# EasyEDA schematic SCH_Pico_funboard_core2_2026-02-18.json
TITLE: RP2040 UCompute; REV: 1.3; Date: 2025-12-27; Sheet: 1/1; Company: Your Company
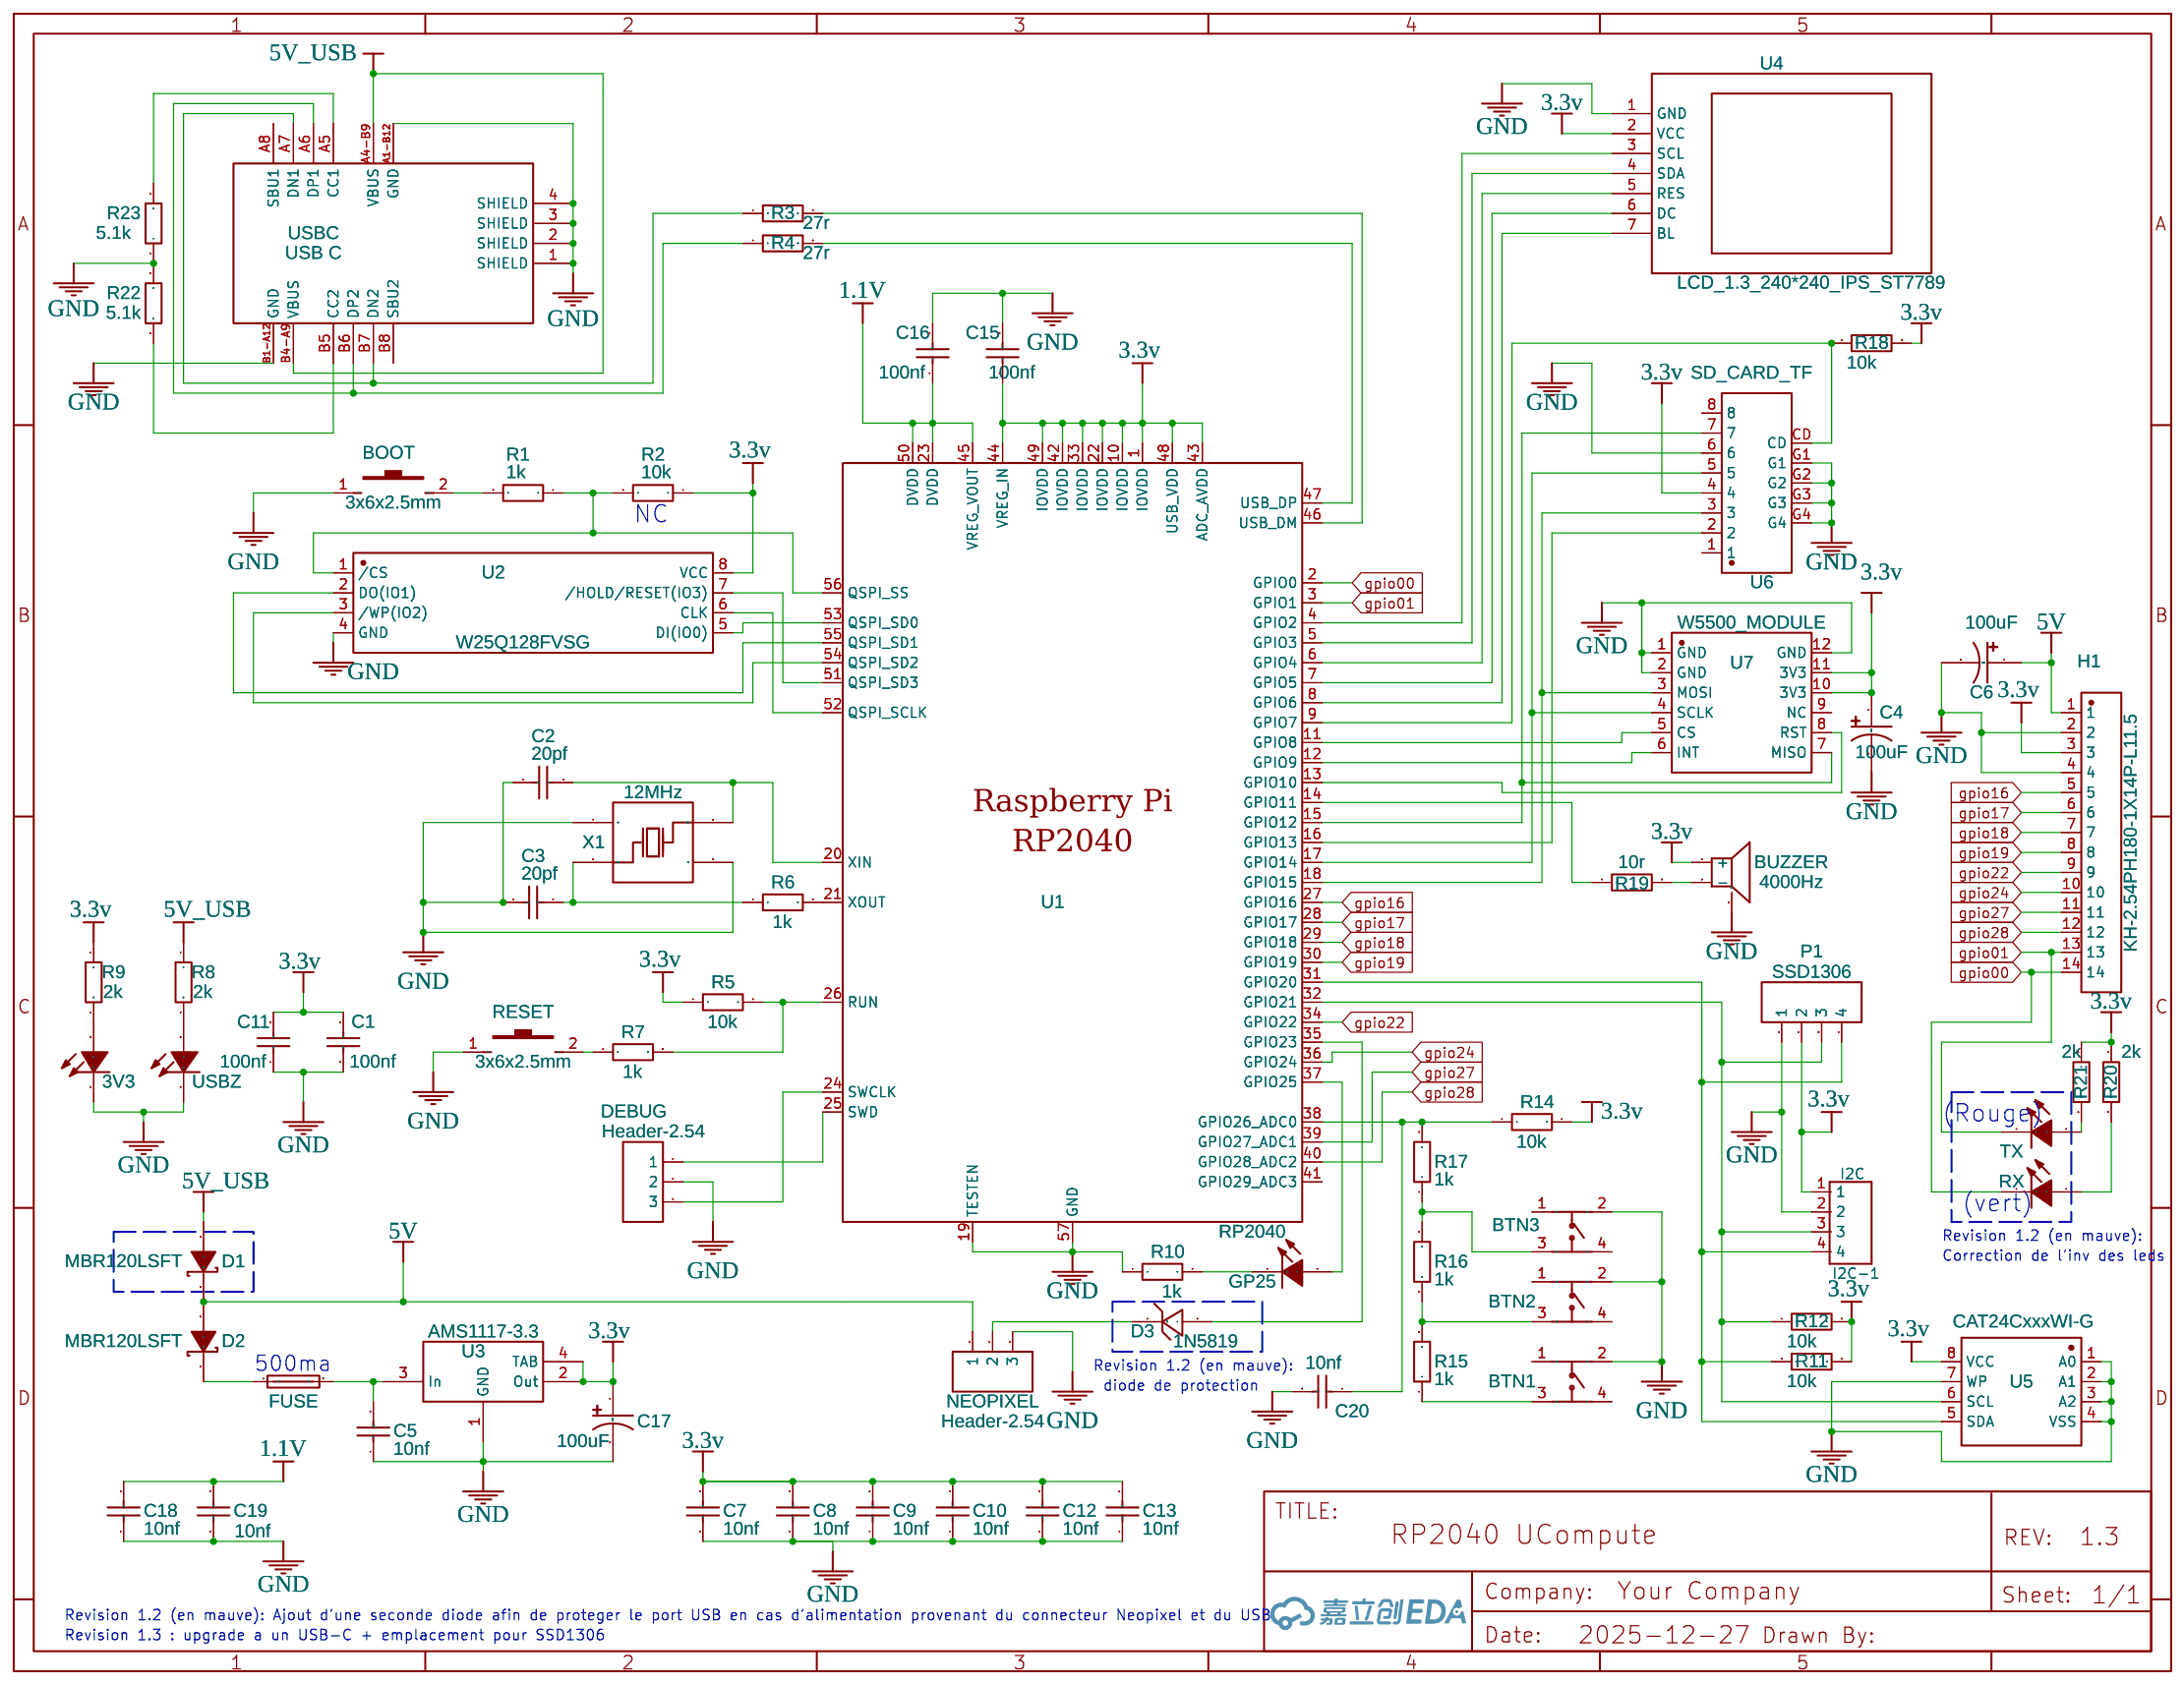
[diagram p0: schematic sheet]

## Parts
3V3  XL-1206QPC  [LED0805-RD_GREEN]
BOOT  3x6x2.5mm  [SW-SMD_L6.0-W3.6-LS8.0]
BTN1  TC-1102-A-J-R  [SW-TH_4P-L6.0-W6.0-P4.50-LS6.5]
BTN2  TC-1102-A-J-R  [SW-TH_4P-L6.0-W6.0-P4.50-LS6.5]
BTN3  TC-1102-A-J-R  [SW-TH_4P-L6.0-W6.0-P4.50-LS6.5]
BUZZER  4000Hz  [BUZ-SMD_3P-L5.2-W5.2-P3.50-BR]
C1  100nf  [C0603]
C2  20pf  [C0603]
C3  20pf  [C0603]
C4  100uF  [CASE-B_3528]
C5  10nf  [C0603]
C6  100uF  [CASE-B_3528]
C7  10nf  [C0603]
C8  10nf  [C0603]
C9  10nf  [C0603]
C10  10nf  [C0603]
C11  100nf  [C0603]
C12  10nf  [C0603]
C13  10nf  [C0603]
C15  100nf  [C0603]
C16  100nf  [C0603]
C17  100uF  [CASE-B_3528]
C18  10nf  [C0603]
C19  10nf  [C0603]
C20  10nf  [C0603]
D1  MBR120LSFT  [DO-214AC_L4.3-W2.7-LS5.3-RD]
D2  MBR120LSFT  [DO-214AC_L4.3-W2.7-LS5.3-RD]
D3  1N5819  [SOD-123_L2.7-W1.6-LS3.7-RD-1]
DEBUG  Header-2.54  [HDR-TH_3P-P2.54-V-M-1]
FUSE  FUSE1206  [F1206]
GP25  XL-1206QPC  [LED0805-RD_BLUE]
H1  KH-2.54PH180-1X14P-L11.5  [HDR-TH_14P-P2.54-V-M]
I2C-1  I2C  [CONN-XH2.54-4PIN]
NEOPIXEL  Header-2.54  [HDR-TH_3P-P2.54-V-M-1]
P1  SSD1306  [HDR-4X1/2.54]
R1  1k  [R0603]
R2  10k  [R0603]
R3  27r  [R0603]
R4  27r  [R0603]
R5  10k  [R0603]
R6  1k  [R0603]
R7  1k  [R0603]
R8  2k  [R0603]
R9  2k  [R0603]
R10  1k  [R0603]
R11  10k  [R0603]
R12  10k  [R0603]
R14  10k  [R0603]
R15  1k  [R0603]
R16  1k  [R0603]
R17  1k  [R0603]
R18  10k  [R0603]
R19  10r  [R0603]
R20  2k  [R0603]
R21  2k  [R0603]
R22  5.1k  [R0603]
R23  5.1k  [R0603]
RESET  3x6x2.5mm  [SW-SMD_L6.0-W3.6-LS8.0]
RX1  RX  [LED0805-RD_BLUE]
TX1  TX  [LED0805-RD_BLUE]
U1  RP2040  [LQFN-56_L7.0-W7.0-P0.4-EP]
U2  W25Q128FVSG  [SOIC-8_L5.2-W5.2-P1.27-LS7.9-BL]
U3  AMS1117-3.3  [SOT-223_L6.5-W3.5-P2.30-LS7.0-BR]
U4  LCD_1.3_240*240_IPS_ST7789  [LCD_1.3_240*240_IPS_ST7789]
U5  CAT24CxxxWI-G  [SOIC-8]
U6  SD_CARD_TF  [MICRO-USB-SMD_MICRO-SD]
U7  W5500_MODULE  [COMM-TH_L25.0-W23.0_W5500_MODULE]
USBC  USB C  [USB-C-SMD_MC-311D]
USBZ  XL-1206QPC  [LED0805-RD_BLUE]
X1  12MHz  [OSC-SMD_4P-L3.2-W2.5-BL]

## Library data of the parts
3V3 GP25 RX1 TX1 USBZ = XL-1206QPC: Supplier: LCSC; Manufacturer: LCSC; Supplier Part: C10781; JLCPCB Part Class: Extended Part; Package Display: No
BOOT RESET = 3x6x2.5mm: Supplier Part: C5382; Supplier: LCSC; Manufacturer: ReliaPro; JLCPCB Part Class: Extended Part
BTN1-BTN3 = TC-1102-A-J-R: Supplier: LCSC; Supplier Part: C2885243; Manufacturer: XKB Connectivity(中国星坤); Contributor: LCSC; JLCPCB Part Class: Extended Part
BUZZER = MLT-5030: Supplier: LCSC; Manufacturer: 华能; Supplier Part: C95297; JLCPCB Part Class: Extended Part
C1-C3 C5 C7-C13 C15 C16 C18-C20 = 0805CG220J500NT: Supplier: LCSC; Manufacturer: FH; Supplier Part: C38143; JLCPCB Part Class: Extended Part
C4 C6 C17 = TLJA107M010R1400: Supplier: LCSC; Supplier Part: C313517; Manufacturer: Kyocera AVX; Contributor: LCSC; JLCPCB Part Class: Extended Part; Package Display: No
D1 D2 = SS110A: Supplier: LCSC; Supplier Part: C211767; Manufacturer: Yangzhou Yangjie Elec Tech; Contributor: LCSC; JLCPCB Part Class: Extended Part
D3 = 1N4148D: Contributor: lcsc; Supplier: LCSC; Supplier Part: C9900023634; Manufacturer: null; JLCPCB Part Class: Extended Part
DEBUG NEOPIXEL = Header-Male-2.54_1x3: Supplier: LCSC; Manufacturer: BOOMELE(博穆精密); Manufacturer Part: 2.54-1*3P针; Supplier Part: C49257; JLCPCB Part Class: Extended Part
FUSE = D22051903536_FUSE1206: Supplier: LCSC; Supplier Part: C9900019275; Manufacturer: null; Manufacturer Part: D22051903536_fuse1206; JLCPCB Part Class: Extended Part; Contributor: lcsc
H1 = KH-2.54PH180-1X14P-L11.5: Contributor: LCSC; Supplier: LCSC; Supplier Part: C2905490; Manufacturer: kinghelm(金航标); JLCPCB Part Class: Extended Part
P1 = Header-Female-2.54_1x4: Supplier: LCSC; Manufacturer: ReliaPro; Supplier Part: C124413
R1-R12 R14-R23 = RC0805DR-071KL: Supplier: LCSC; Manufacturer: YAGEO(国巨); Contributor: LCSC; Supplier Part: C100051; JLCPCB Part Class: Extended Part; Resistance: 1kΩ
U1 = RP2040: Supplier: LCSC; Supplier Part: C2040; Manufacturer: Raspberry Pi(树莓派); JLCPCB Part Class: Extended Part; Contributor: LCSC
U2 = W25Q128FVSG: Supplier: LCSC; Supplier Part: C9900022211; Manufacturer: null; JLCPCB Part Class: Extended Part; Contributor: lcsc
U3 = AMS1117-5.0_C165483: Supplier: LCSC; Supplier Part: C165483; Manufacturer: SK; Manufacturer Part: AMS1117-5.0; Contributor: LCSC; JLCPCB Part Class: Extended Part
U4 = LCD_1.3_240*240_IPS_ST7789: Contributor: puzrin
U5 = CAT24C256WI-G
U6 = SD_CARD_TF: Supplier: LCSC; Supplier Part: C9900016722; Manufacturer: null; Manufacturer Part: SD_Card_TF; Contributor: lcsc; JLCPCB Part Class: Extended Part
U7 = W5500_MODULE: Supplier: LCSC; Supplier Part: C9900160625; Manufacturer: null
USBC = USB C: Supplier: LCSC; Supplier Part: C136423; Manufacturer: SOFNG; Manufacturer Part: MC-311D; Contributor: La Ode Muhamad Idris
X1 = TSX-3225 12MHz 20pF 30ppm: Supplier: LCSC; Manufacturer: EPSON; Supplier Part: C91751; JLCPCB Part Class: Extended Part

## Nets
1.1V: C16.1 C18.2 C19.2 U1.23(DVDD) U1.45(VREG_VOUT) U1.50(DVDD)
3.3v: BUZZER.2(+) C1.1 C4.1 C7.2 C8.2 C9.2 C10.2 C11.2 C12.2 C13.2 C15.1 C17.1 H1.3 I2C-1.1 P1.2 R2.1 R5.1 R9.1 R11.2 R12.2 R14.2 R18.2 R20.1 R21.1 U1.1(IOVDD) U1.10(IOVDD) U1.22(IOVDD) U1.33(IOVDD) U1.42(IOVDD) U1.43(ADC_AVDD) U1.44(VREG_IN) U1.48(USB_VDD) U1.49(IOVDD) U2.8(VCC) U3.2(Out) U3.4(TAB) U4.2(VCC) U5.8(VCC) U6.4 U7.10(3V3) U7.11(3V3)
5V: C6.1 D1.2(A) D2.1(K) H1.1 NEOPIXEL.1
5V_USB: D2.2(A) R8.1 USBC.A4-B9(VBUS) USBC.B4-A9(VBUS)
GND: 3V3.1(K) BOOT.1 BTN1.2 BTN2.2 BTN3.2 BUZZER.1(NC) C1.2 C2.1 C3.1 C4.2 C5.1 C6.2 C7.1 C8.1 C9.1 C10.1 C11.1 C12.1 C13.1 C15.2 C16.2 C17.2 C18.1 C19.1 C20.2 DEBUG.2 H1.2 H1.4 I2C-1.2 NEOPIXEL.3 P1.1 R10.1 R22.2 R23.1 RESET.1 U1.19(TESTEN) U1.57(GND) U2.4(GND) U3.1(GND) U4.1(GND) U5.1(A0) U5.2(A1) U5.3(A2) U5.4(VSS) U5.7(WP) U6.6 U6.G1 U6.G2 U6.G3 U6.G4 U7.1(GND) U7.2(GND) U7.12(GND) USBC.1(SHIELD) USBC.2(SHIELD) USBC.3(SHIELD) USBC.4(SHIELD) USBC.A1-B12(GND) USBC.B1-A12(GND) USBZ.1(K) X1.2(NC) X1.4(NC)
gpio00: H1.14 RX1.1(K) U1.2(GPIO0)
gpio01: H1.13 TX1.1(K) U1.3(GPIO1)
gpio16: H1.5 U1.27(GPIO16)
gpio17: H1.6 U1.28(GPIO17)
gpio18: H1.7 U1.29(GPIO18)
gpio19: H1.8 U1.30(GPIO19)
gpio22: H1.9 U1.34(GPIO22)
gpio24: H1.10 U1.36(GPIO24)
gpio27: H1.11 U1.39(GPIO27_ADC1)
gpio28: H1.12 U1.40(GPIO28_ADC2)
Net-(3V3-2): 3V3.2(A) R9.2
Net-(BOOT-2): BOOT.2 R1.2
Net-(BTN1-3): BTN1.3 R15.1
Net-(BTN2-3): BTN2.3 R15.2 R16.1
Net-(BTN3-3): BTN3.3 R16.2 R17.1
Net-(BUZZER-3): BUZZER.3(-) R19.2
Net-(C2-2): C2.2 U1.20(XIN) X1.3(OSC2)
Net-(C3-2): C3.2 R6.1 X1.1(OSC1)
Net-(C5-2): C5.2 FUSE.2 U3.3(In)
Net-(C20-1): C20.1 R14.1 R17.2 U1.38(GPIO26_ADC0)
Net-(D1-1): D1.1(K) FUSE.1
Net-(D3-1): D3.1(C) NEOPIXEL.2
Net-(D3-2): D3.2(A) U1.35(GPIO23)
Net-(DEBUG-1): DEBUG.1 U1.25(SWD)
Net-(DEBUG-3): DEBUG.3 U1.24(SWCLK)
Net-(GP25-1): GP25.1(K) R10.2
Net-(GP25-2): GP25.2(A) U1.37(GPIO25)
Net-(I2C-1-3): I2C-1.3 P1.3 R12.1 U1.32(GPIO21) U5.6(SCL)
Net-(I2C-1-4): I2C-1.4 P1.4 R11.1 U1.31(GPIO20) U5.5(SDA)
Net-(R1-1): R1.1 R2.2 U1.56(QSPI_SS) U2.1(/CS)
Net-(R3-1): R3.1 USBC.A7(DN1) USBC.B7(DN2)
Net-(R3-2): R3.2 U1.46(USB_DM)
Net-(R4-1): R4.1 USBC.A6(DP1) USBC.B6(DP2)
Net-(R4-2): R4.2 U1.47(USB_DP)
Net-(R5-2): R5.2 R7.2 U1.26(RUN)
Net-(R6-2): R6.2 U1.21(XOUT)
Net-(R7-1): R7.1 RESET.2
Net-(R8-2): R8.2 USBZ.2(A)
Net-(R18-1): R18.1 U1.9(GPIO7) U6.CD
Net-(R19-1): R19.1 U1.14(GPIO11)
Net-(R20-2): R20.2 RX1.2(A)
Net-(R21-2): R21.2 TX1.2(A)
Net-(R22-1): R22.1 USBC.B5(CC2)
Net-(R23-2): R23.2 USBC.A5(CC1)
Net-(U1-4): U1.4(GPIO2) U4.3(SCL)
Net-(U1-5): U1.5(GPIO3) U4.4(SDA)
Net-(U1-6): U1.6(GPIO4) U4.5(RES)
Net-(U1-7): U1.7(GPIO5) U4.6(DC)
Net-(U1-8): U1.8(GPIO6) U4.7(BL)
Net-(U1-11): U1.11(GPIO8) U7.5(CS)
Net-(U1-12): U1.12(GPIO9) U7.6(INT)
Net-(U1-13): U1.13(GPIO10) U7.8(RST)
Net-(U1-15): U1.15(GPIO12) U6.7 U7.7(MISO)
Net-(U1-16): U1.16(GPIO13) U6.2
Net-(U1-17): U1.17(GPIO14) U6.5 U7.4(SCLK)
Net-(U1-18): U1.18(GPIO15) U6.3 U7.3(MOSI)
Net-(U1-51): U1.51(QSPI_SD3) U2.7(/HOLD/RESET(IO3))
Net-(U1-52): U1.52(QSPI_SCLK) U2.6(CLK)
Net-(U1-53): U1.53(QSPI_SD0) U2.5(DI(IO0))
Net-(U1-54): U1.54(QSPI_SD2) U2.3(/WP(IO2))
Net-(U1-55): U1.55(QSPI_SD1) U2.2(DO(IO1))

Not connected (* = marked no-connect by the designer): BTN1 1 4; BTN2 1 4; BTN3 1 4; U1 41(GPIO29_ADC3); U6 1 8; U7 9(NC); USBC A8(SBU1) B8(SBU2)

## Notes on the sheet
- NC
- (Rouge)
- (vert)
- Correction de l'inv des leds
- Revision 1.2 (en mauve):
- 500ma
- Revision 1.2 (en mauve):
- diode de protection
- Revision 1.2 (en mauve): Ajout d'une seconde diode afin de proteger le port USB en cas d'alimentation provenant du connecteur Neopixel et du USB
- Revision 1.3 : upgrade a un USB-C + emplacement pour SSD1306
